# Altium schematic sheet 电源.SchDoc
size A3
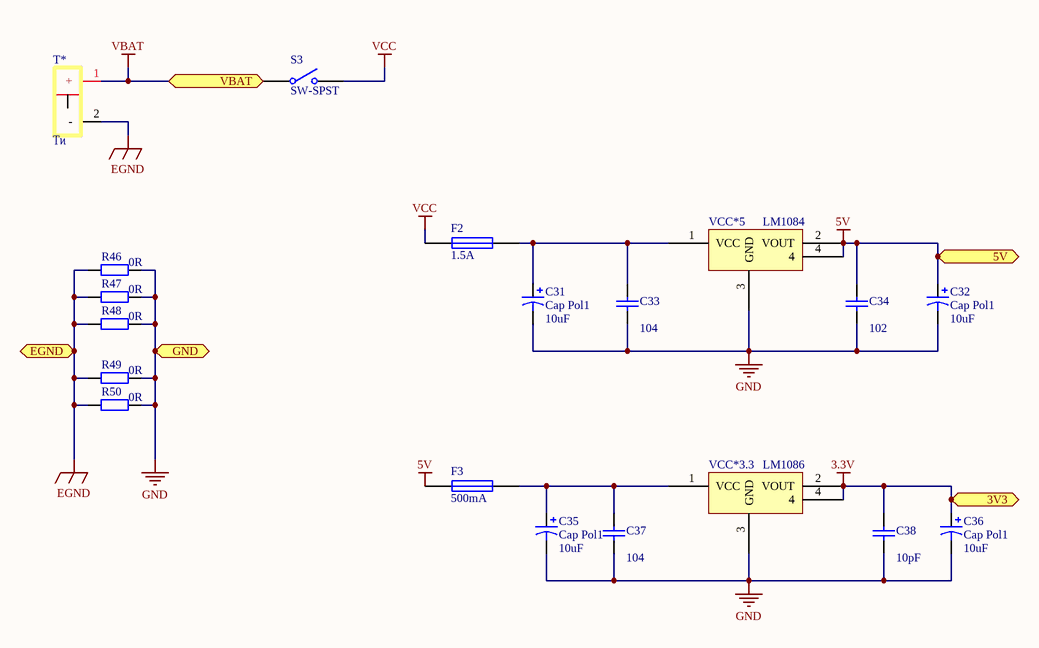
[diagram p0: 电源.SchDoc]

## Parts
C31  Cap Pol1  value 10uF  [1206(2)]
C32  Cap Pol1  value 10uF  [1206(2)]
C33  value 104  [C2012]  (hidden comment: Cap)
C34  value 102  [C2012]  (hidden comment: Cap)
C35  Cap Pol1  value 10uF  [1206(2)]
C36  Cap Pol1  value 10uF  [1206(2)]
C37  value 104  [C2012]  (hidden comment: Cap)
C38  value 10pF  [C2012]  (hidden comment: Cap)
F2  1.5A  [1206(2)]
F3  500mA  [1206(2)]
R46  value 0R  [1206(2)]  (hidden comment: Res2)
R47  value 0R  [1206(2)]  (hidden comment: Res2)
R48  value 0R  [1206(2)]  (hidden comment: Res2)
R49  value 0R  [1206(2)]  (hidden comment: Res2)
R50  value 0R  [1206(2)]  (hidden comment: Res2)
S3  SW-SPST  [SW-125V6A(-)]
T*  Tͷ  [T插]
VCC*3.3  LM1086  [DPAK LM2940]
VCC*5  LM1084  [DPAK LM2940]

## Ports
3V3, 5V, EGND, GND, VBAT

## Nets
3.3V: C36.1 C38.2 VCC*3.3.2(VOUT) VCC*3.3.4 ; port 3V3
5V: C32.1 C34.2 F3.1 VCC*5.2(VOUT) VCC*5.4 ; port 5V
EGND: R46.2 R47.2 R48.2 R49.2 R50.2 T*.2(-) ; port EGND
GND: C31.2 C32.2 C33.1 C34.1 C35.2 C36.2 C37.1 C38.1 R46.1 R47.1 R48.1 R49.1 R50.1 VCC*3.3.3(GND) VCC*5.3(GND) ; port GND
VBAT: S3.1(COMMON) T*.1(+) ; port VBAT
VCC: F2.1 S3.2(NO)
NetC31_1: C31.1 C33.2 F2.2 VCC*5.1(VCC)
NetC35_1: C35.1 C37.2 F3.2 VCC*3.3.1(VCC)

## Library data of the parts
C31 C32 C35 C36 = Cap Pol1: Polarized Capacitor (Radial); Published: 8-Jun-2000; LatestRevisionDate: 17-Jul-2002; LatestRevisionNote: Re-released for DXP Platform.; PackageReference: RB7.6-15; Publisher: Altium Limited; PackageDescription: Polarized Capacitor (Radial); 2 Leads
C33 C34 C37 C38 = Cap: 贴片电容; Published: 8-Jun-2000; LatestRevisionDate: 17-Jul-2002; LatestRevisionNote: Re-released for DXP Platform.; PackageReference: RAD-0.3; Publisher: Altium Limited
F2 F3 = Fuse 1: Fuse; Published: 8-Jun-2000; LatestRevisionDate: 17-Jul-2002; LatestRevisionNote: Re-released for DXP Platform.; PackageReference: PIN-W2/E2.8; Publisher: Altium Limited
R46-R50 = Res2: Resistor; Published: 8-Jun-2000; LatestRevisionDate: 17-Jul-2002; LatestRevisionNote: Re-released for DXP Platform.; PackageReference: AXIAL-0.4; Publisher: Altium Limited; PackageDescription: Axial Device, Thru-Hole; 2 Leads; 0.4 in Pin Spacing
S3 = SW-SPST: Single-Pole, Single-Throw Switch; pin to pad: 1>2 2>1; Published: 24-Mar-1999; LatestRevisionDate: 17-Jul-2002; LatestRevisionNote: Re-released for DXP Platform.; PackageReference: SPST-2; Publisher: Altium Limited
VCC*3.3 VCC*5 = LM1086: pin to pad: 1>3 3>1